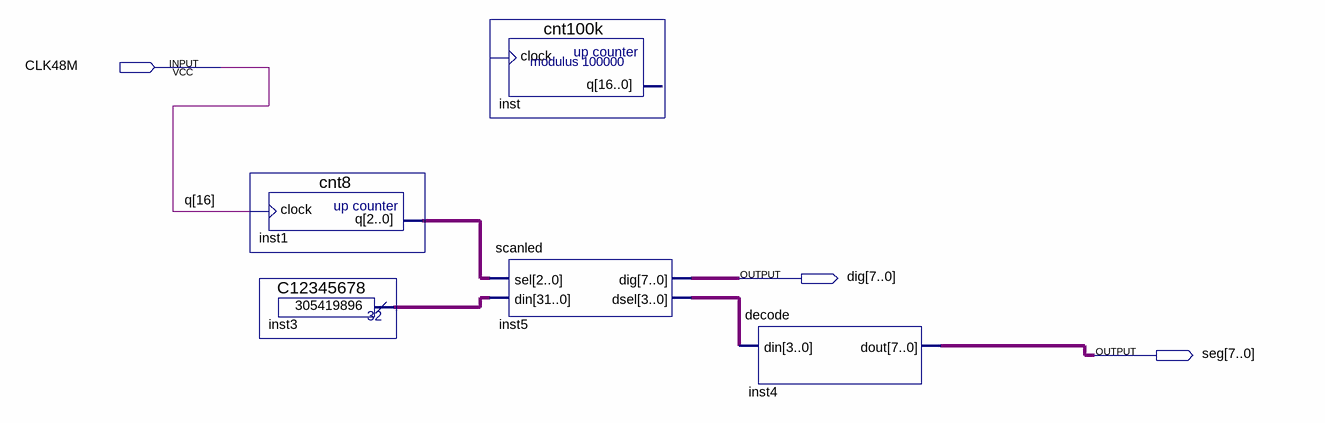
[diagram p0: schematic sheet]
// Quartus schematic dled_17990425.bdf as structural Verilog: 5 symbols, 3 pins
module dled_17990425 (
  input  CLK48M,
  output [7:0] dig,
  output [7:0] seg
);

  wire [2:0] inst1_q;
  wire [3:0] inst5_dsel;
  wire [31:0] inst3_result;

  cnt8 inst1 (.clock(CLK48M), .q(inst1_q));
  C12345678 inst3 (.result(inst3_result));
  cnt100k inst ();  // open: clock, q
  scanled inst5 (.sel(inst1_q), .din(inst3_result), .dig(dig), .dsel(inst5_dsel));
  decode inst4 (.din(inst5_dsel), .dout(seg));

  // Other names for the same wires on the sheet: q[16] = CLK48M
endmodule
